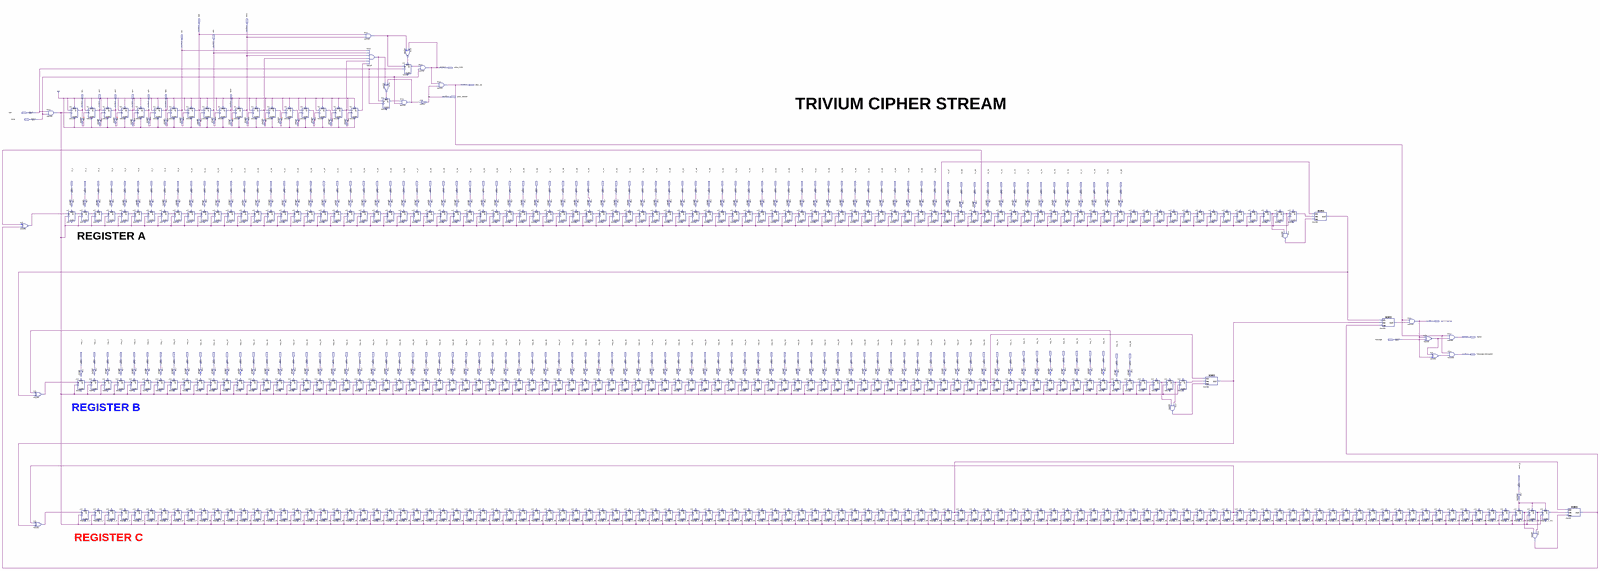
[diagram p0: schematic sheet, whole]
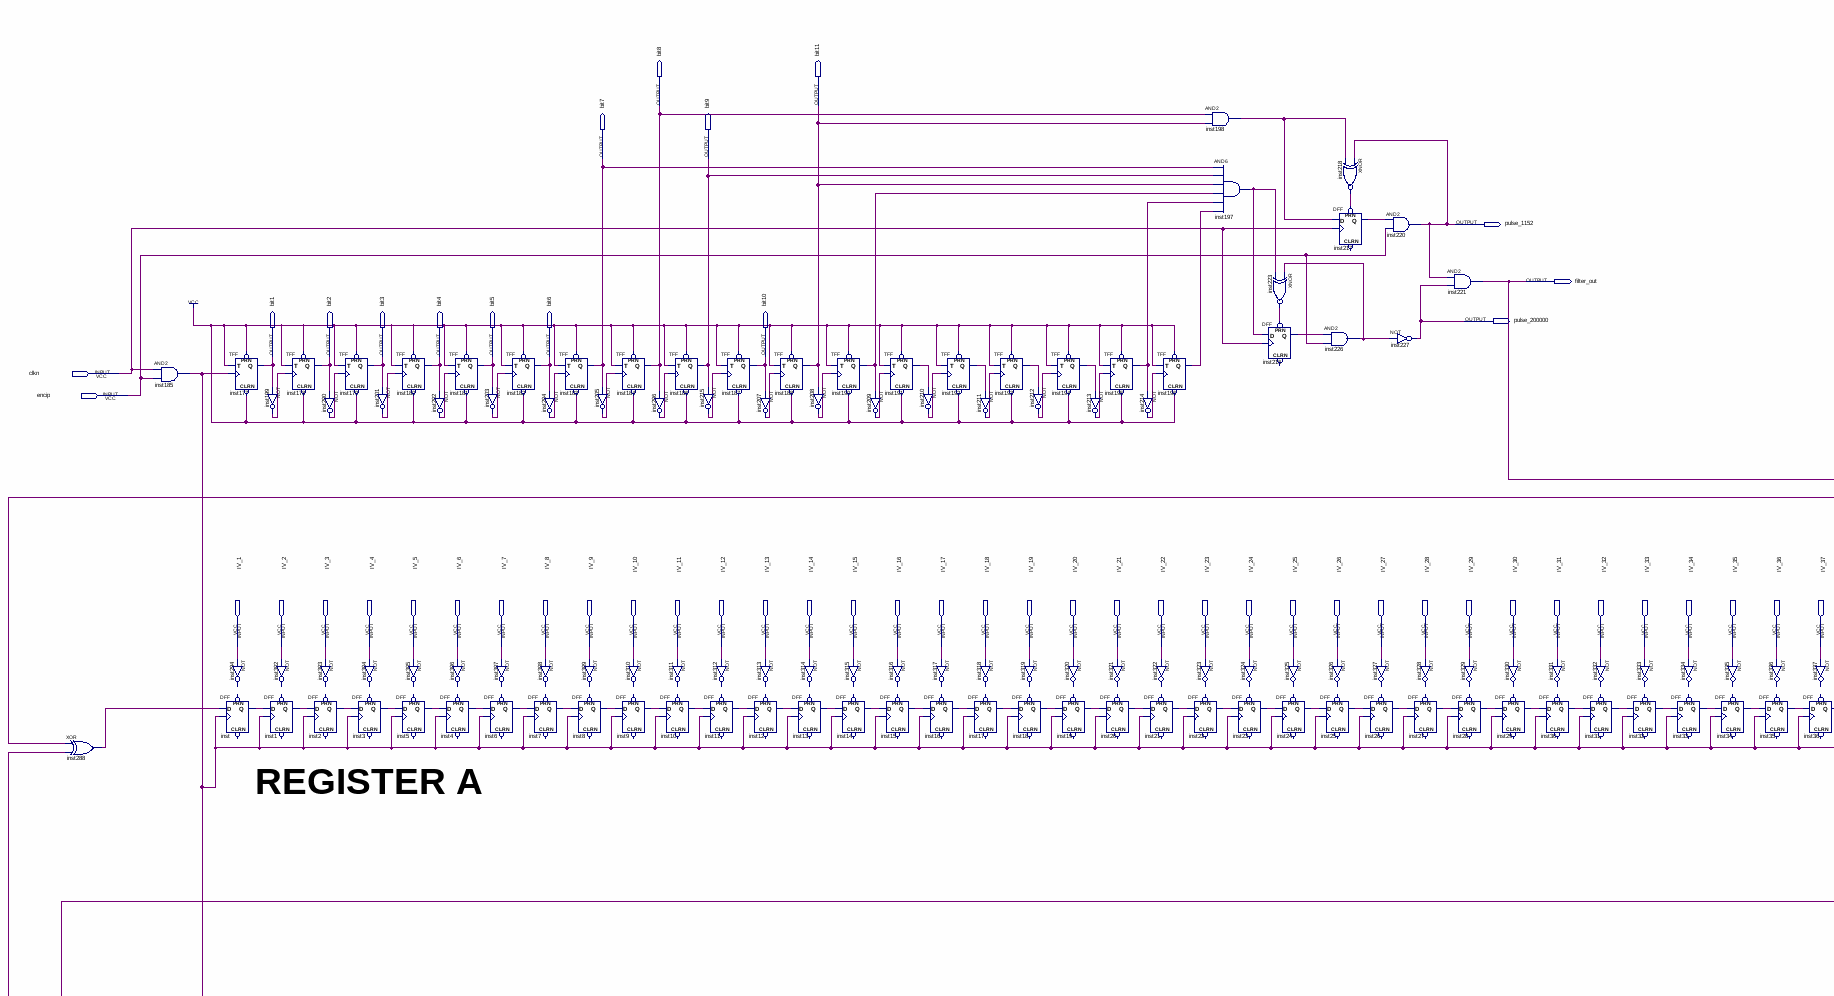
[diagram p1: schematic sheet, upper left part]
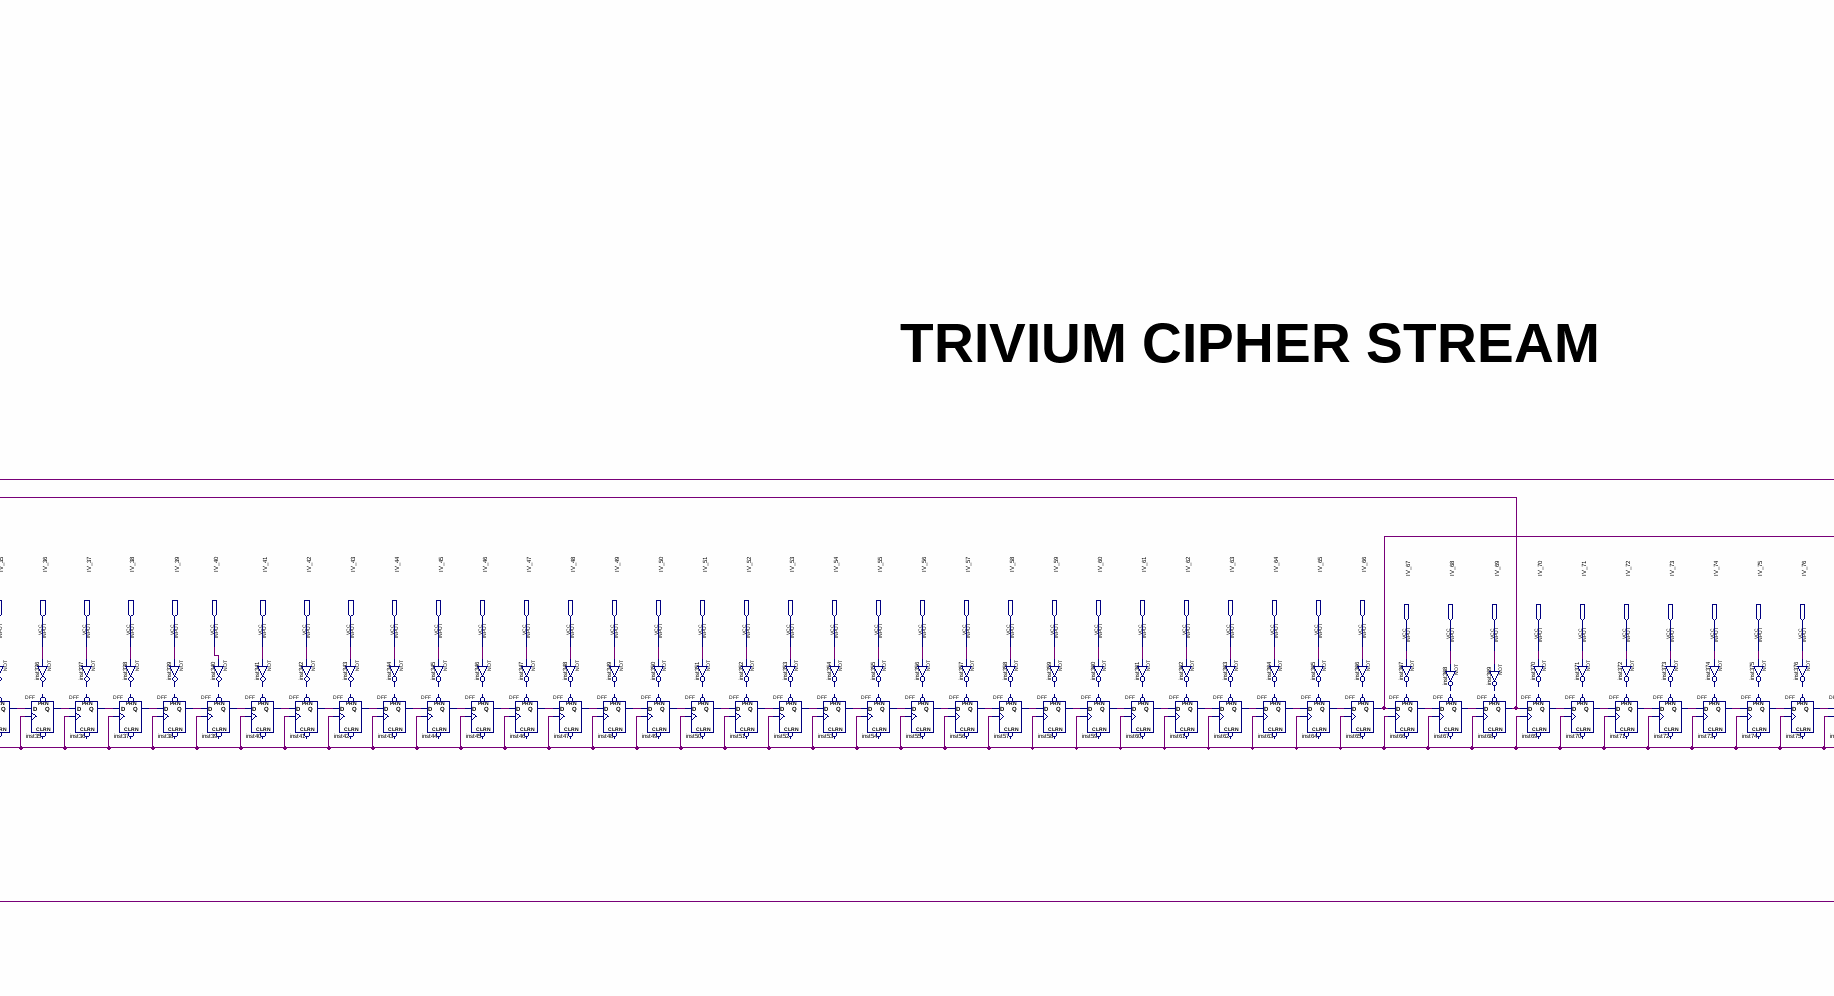
[diagram p2: schematic sheet, upper centre part]
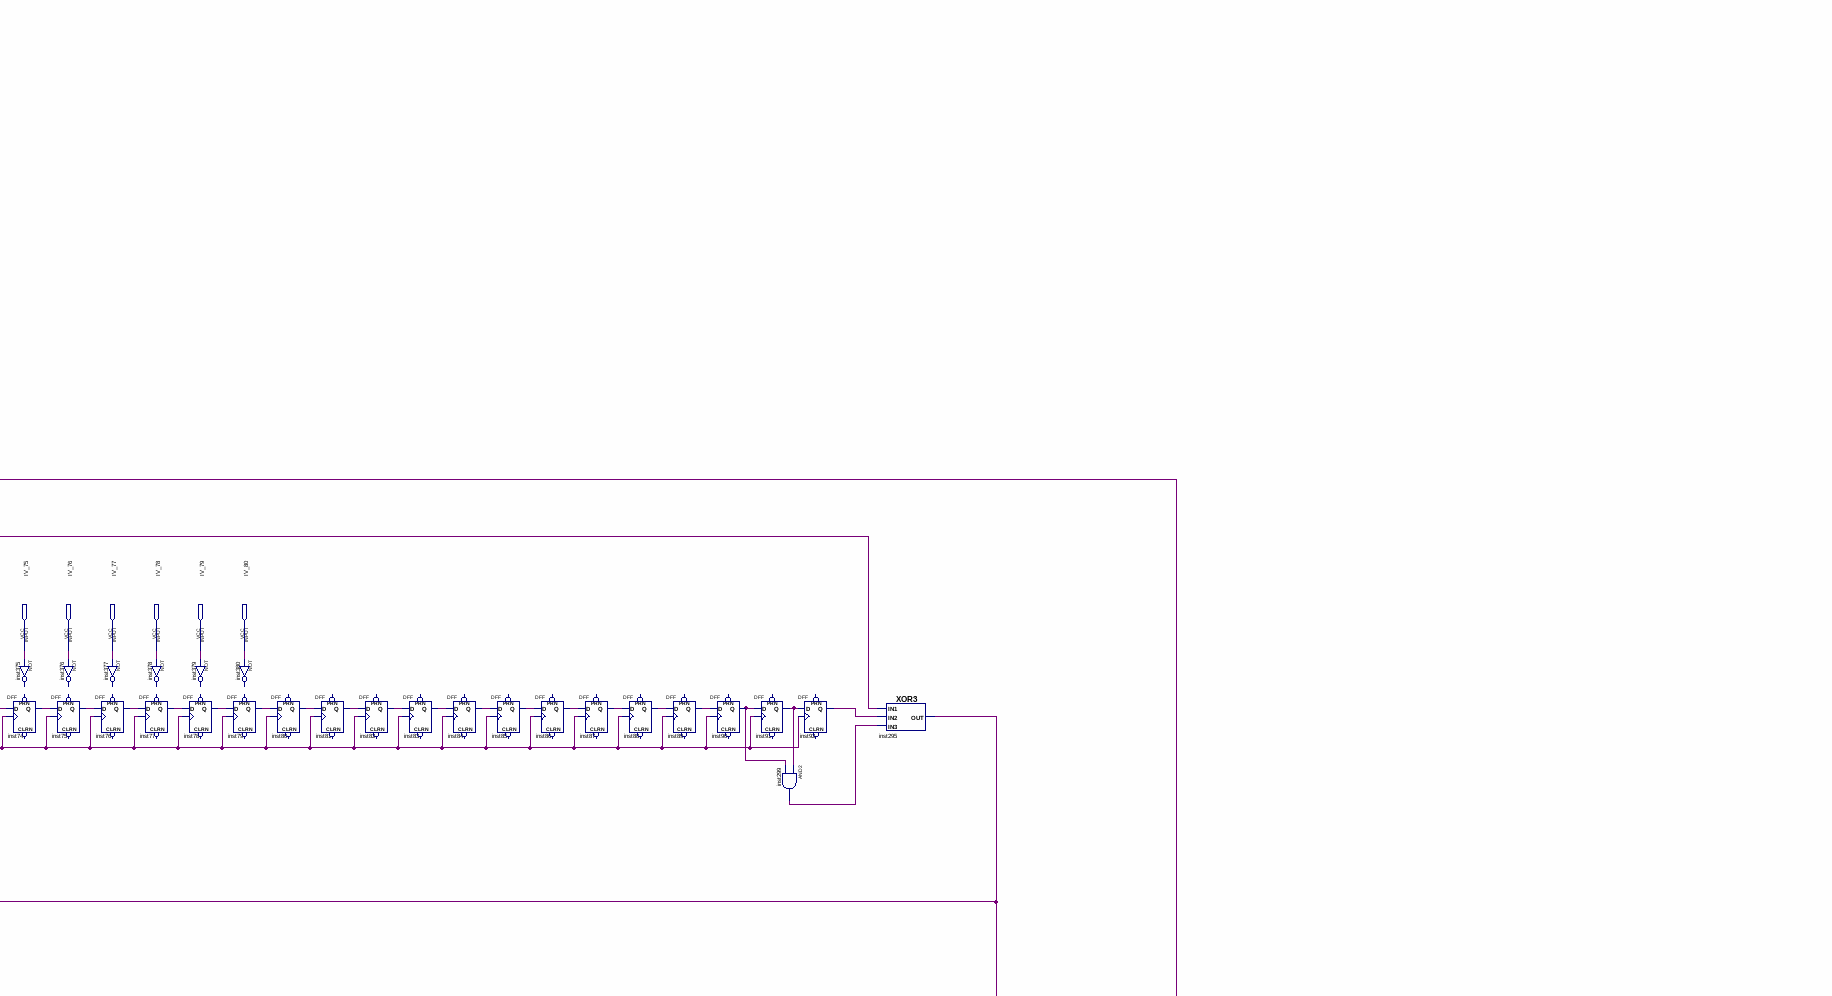
[diagram p3: schematic sheet, upper right part]
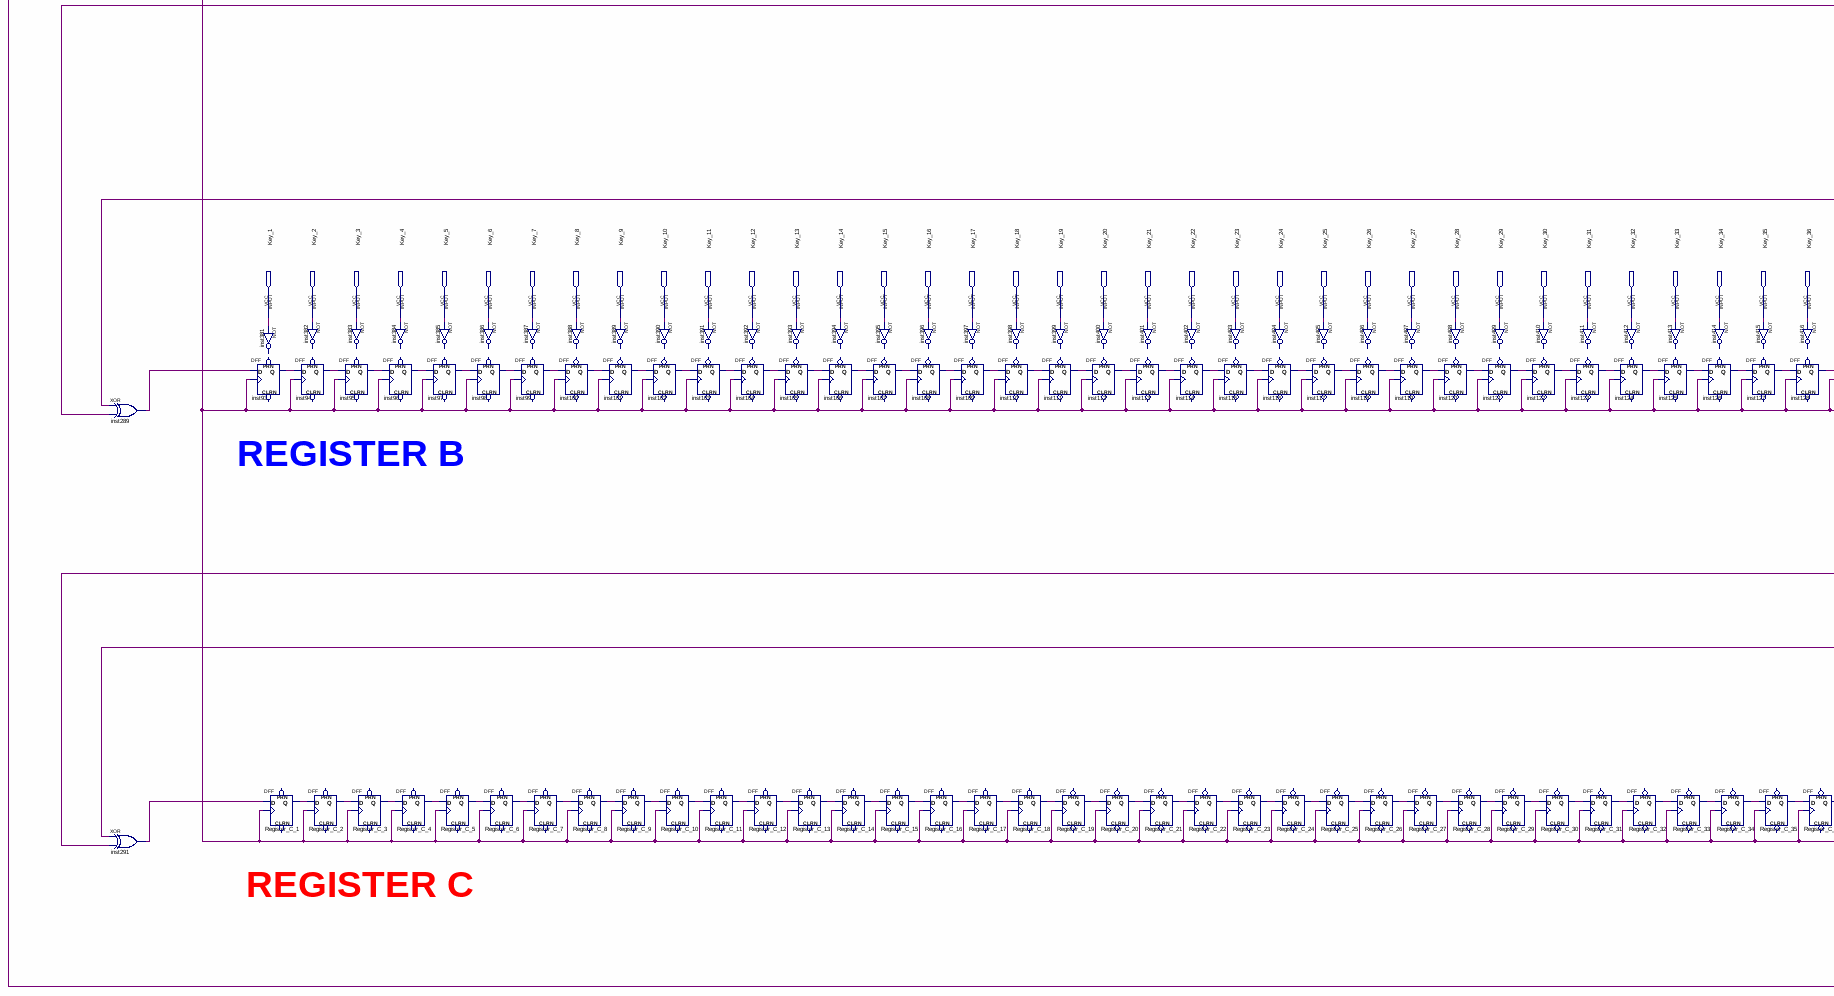
[diagram p4: schematic sheet, lower left part]
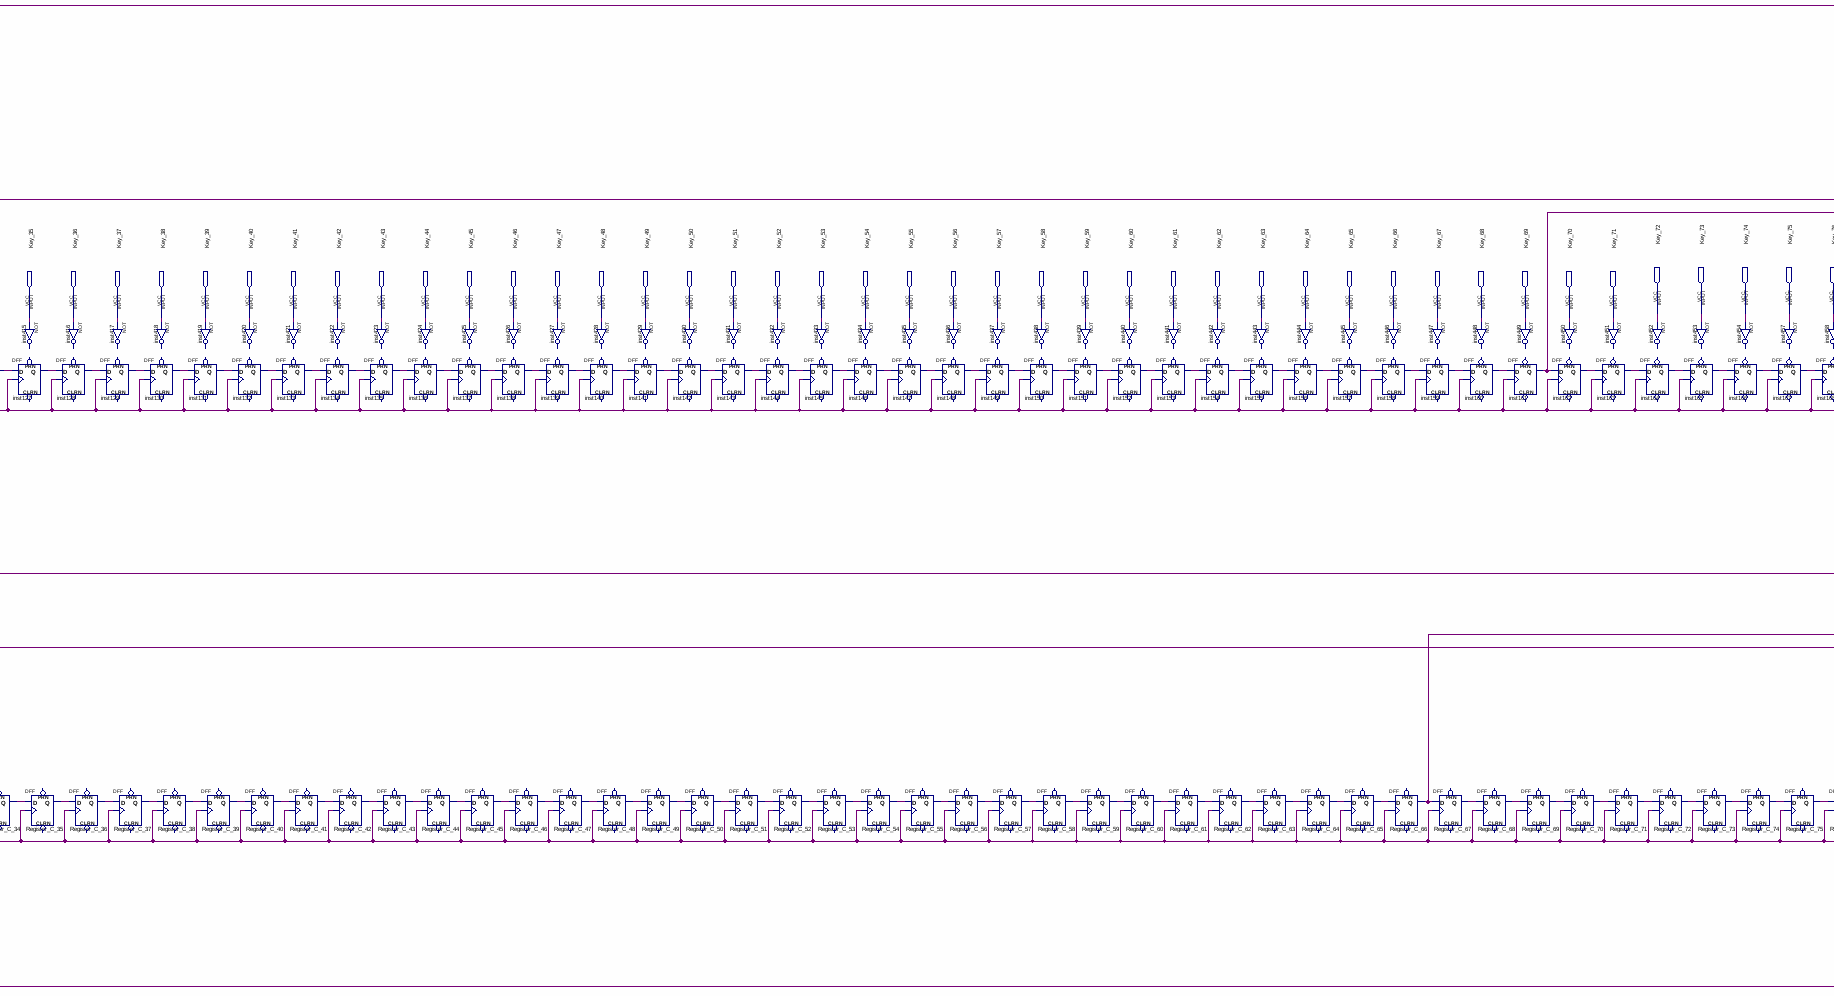
[diagram p5: schematic sheet, lower centre part]
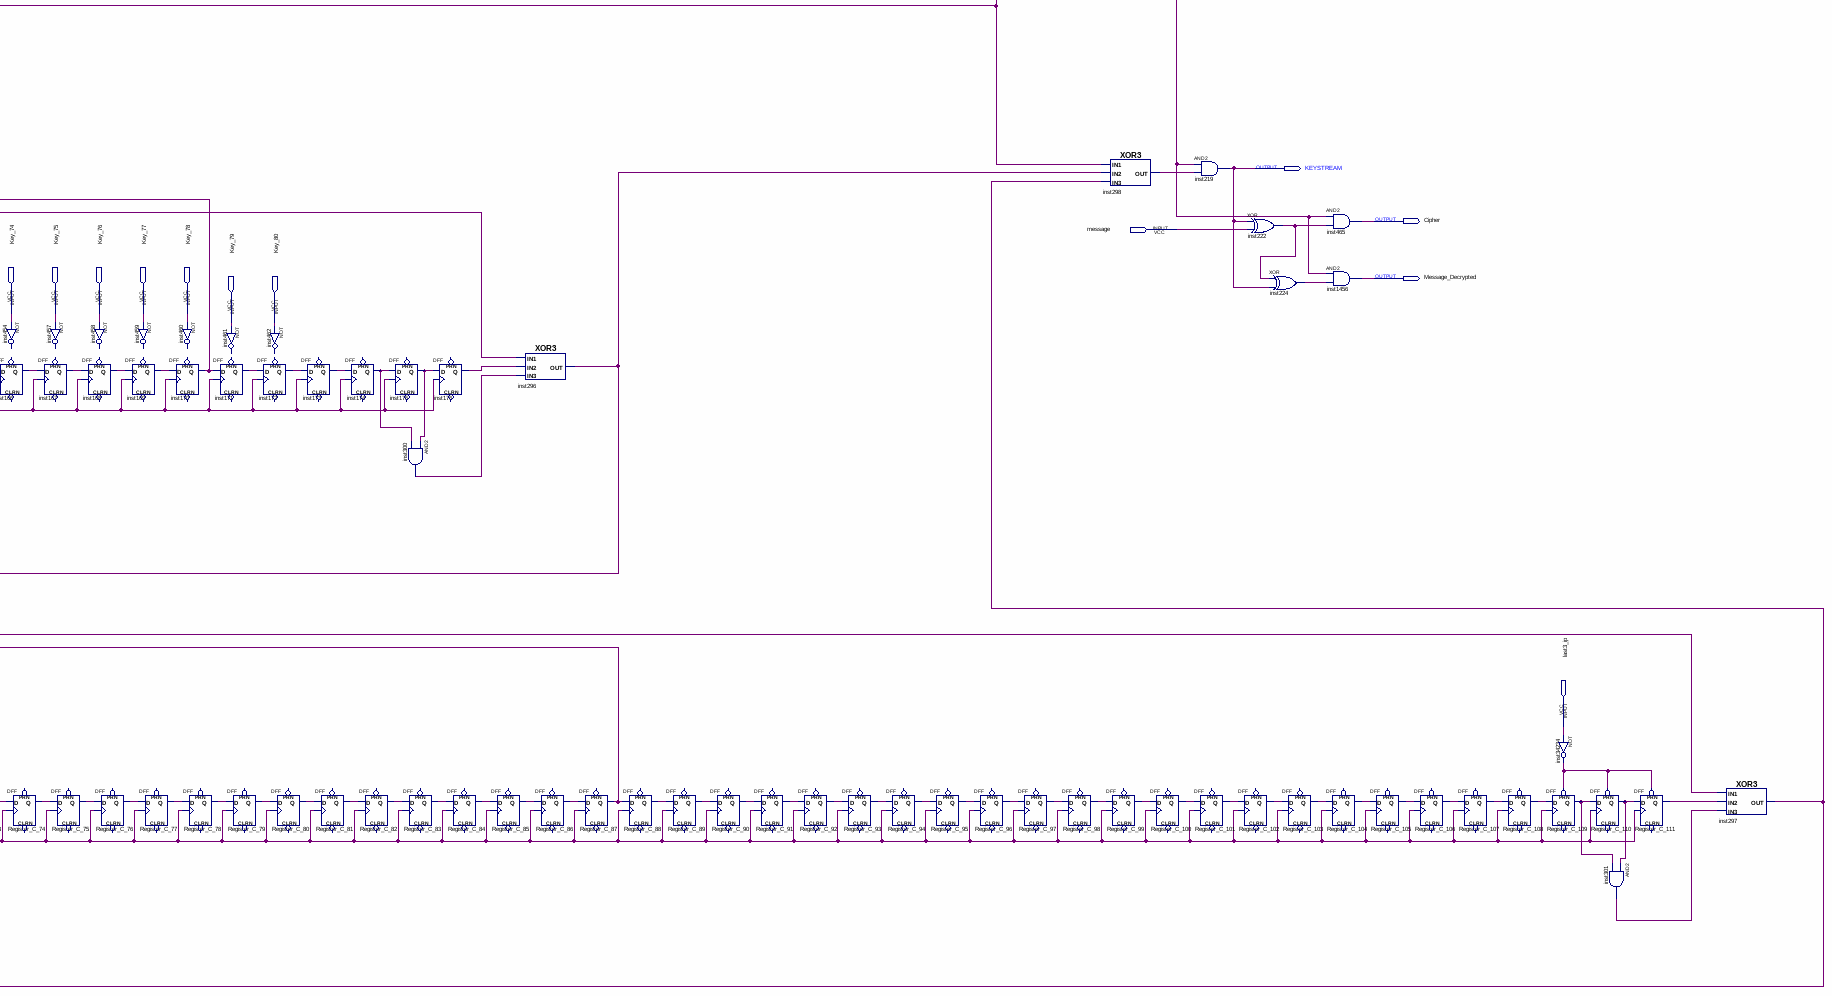
[diagram p6: schematic sheet, lower right part]
// Quartus schematic trivium1.bdf as structural Verilog: 510 symbols, 181 pins
module trivium1 (
  input  clkn,
  input  encip,
  input  IV_1,
  input  IV_2,
  input  IV_3,
  input  IV_4,
  input  IV_5,
  input  IV_6,
  input  IV_7,
  input  IV_8,
  input  IV_9,
  input  IV_10,
  input  IV_11,
  input  IV_12,
  input  IV_13,
  input  IV_14,
  input  IV_15,
  input  IV_16,
  input  IV_17,
  input  IV_18,
  input  IV_19,
  input  IV_20,
  input  IV_21,
  input  IV_22,
  input  IV_23,
  input  IV_24,
  input  IV_25,
  input  IV_26,
  input  IV_27,
  input  IV_28,
  input  IV_29,
  input  IV_30,
  input  IV_31,
  input  IV_32,
  input  IV_33,
  input  IV_34,
  input  IV_35,
  input  IV_36,
  input  IV_37,
  input  IV_38,
  input  IV_39,
  input  IV_40,
  input  IV_41,
  input  IV_42,
  input  IV_43,
  input  IV_44,
  input  IV_45,
  input  IV_46,
  input  IV_47,
  input  IV_48,
  input  IV_49,
  input  IV_50,
  input  IV_51,
  input  IV_52,
  input  IV_53,
  input  IV_54,
  input  IV_55,
  input  IV_56,
  input  IV_57,
  input  IV_58,
  input  IV_59,
  input  IV_60,
  input  IV_61,
  input  IV_62,
  input  IV_63,
  input  IV_64,
  input  IV_65,
  input  IV_66,
  input  IV_67,
  input  IV_68,
  input  IV_69,
  input  IV_70,
  input  IV_71,
  input  IV_72,
  input  IV_73,
  input  IV_74,
  input  IV_75,
  input  IV_76,
  input  IV_77,
  input  IV_78,
  input  IV_79,
  input  IV_80,
  input  message,
  input  Key_72,
  input  Key_73,
  input  Key_74,
  input  Key_75,
  input  Key_76,
  input  Key_77,
  input  Key_78,
  input  Key_1,
  input  Key_2,
  input  Key_3,
  input  Key_4,
  input  Key_5,
  input  Key_6,
  input  Key_7,
  input  Key_8,
  input  Key_9,
  input  Key_10,
  input  Key_11,
  input  Key_12,
  input  Key_13,
  input  Key_14,
  input  Key_15,
  input  Key_16,
  input  Key_17,
  input  Key_18,
  input  Key_19,
  input  Key_20,
  input  Key_21,
  input  Key_22,
  input  Key_23,
  input  Key_24,
  input  Key_25,
  input  Key_26,
  input  Key_27,
  input  Key_28,
  input  Key_29,
  input  Key_30,
  input  Key_31,
  input  Key_32,
  input  Key_33,
  input  Key_34,
  input  Key_35,
  input  Key_36,
  input  Key_37,
  input  Key_38,
  input  Key_39,
  input  Key_40,
  input  Key_41,
  input  Key_42,
  input  Key_43,
  input  Key_44,
  input  Key_45,
  input  Key_46,
  input  Key_47,
  input  Key_48,
  input  Key_49,
  input  Key_50,
  input  Key_51,
  input  Key_52,
  input  Key_53,
  input  Key_54,
  input  Key_55,
  input  Key_56,
  input  Key_57,
  input  Key_58,
  input  Key_59,
  input  Key_60,
  input  Key_61,
  input  Key_62,
  input  Key_63,
  input  Key_64,
  input  Key_65,
  input  Key_66,
  input  Key_67,
  input  Key_68,
  input  Key_69,
  input  Key_70,
  input  Key_71,
  input  Key_79,
  input  Key_80,
  input  last3_ip,
  output bit8,
  output bit11,
  output bit7,
  output bit9,
  output pulse_1152,
  output filter_out,
  output pulse_200000,
  output bit1,
  output bit2,
  output bit3,
  output bit4,
  output bit5,
  output bit6,
  output bit10,
  output KEYSTREAM,
  output Cipher,
  output Message_Decrypted
);

  wire inst1_q, inst2_q, inst3_q, inst4_q, inst5_q, inst6_q, inst7_q, inst8_q, inst9_q, inst10_q, inst11_q,
       inst12_q, inst13_q, inst14_q, inst15_q, inst16_q, inst17_q, inst18_q, inst19_q, inst20_q, inst21_q,
       inst22_q, inst23_q, inst24_q, inst25_q, inst26_q, inst27_q, inst28_q, inst29_q, inst30_q, inst31_q,
       inst32_q, inst33_q, inst34_q, inst35_q, inst36_q, inst37_q, inst38_q, inst39_q, inst40_q, inst41_q,
       inst42_q, inst43_q, inst44_q, inst45_q, inst46_q, inst47_q, inst48_q, inst49_q, inst50_q, inst51_q,
       inst52_q, inst53_q, inst54_q, inst55_q, inst56_q, inst57_q, inst58_q, inst59_q, inst60_q, inst61_q,
       inst62_q, inst63_q, inst64_q, inst65_q, inst66_q, inst67_q, inst68_q, inst69_q, inst70_q, inst71_q,
       inst72_q, inst73_q, inst74_q, inst75_q, inst76_q, inst77_q, inst78_q, inst79_q, inst80_q, inst81_q,
       inst82_q, inst83_q, inst84_q, inst85_q, inst86_q, inst87_q, inst88_q, inst89_q, inst90_q, inst91_q,
       inst92_q, inst93_q, inst94_q, inst95_q, inst96_q, inst97_q, inst98_q, inst99_q, inst100_q, inst101_q,
       inst102_q, inst103_q, inst104_q, inst105_q, inst106_q, inst107_q, inst108_q, inst109_q, inst110_q,
       inst111_q, inst112_q, inst113_q, inst114_q, inst115_q, inst116_q, inst117_q, inst118_q, inst119_q,
       inst120_q, inst121_q, inst122_q, inst123_q, inst124_q, inst125_q, inst126_q, inst127_q, inst128_q,
       inst129_q, inst130_q, inst131_q, inst132_q, inst133_q, inst134_q, inst135_q, inst136_q, inst137_q,
       inst138_q, inst139_q, inst140_q, inst141_q, inst142_q, inst143_q, inst144_q, inst145_q, inst146_q,
       inst147_q, inst148_q, inst149_q, inst150_q, inst151_q, inst152_q, inst153_q, inst154_q, inst155_q,
       inst156_q, inst157_q, inst158_q, inst159_q, inst160_q, inst161_q, inst162_q, inst163_q, inst164_q,
       inst165_q, inst166_q, inst167_q, inst168_q, inst169_q, inst170_q, inst171_q, inst172_q, inst173_q,
       inst174_q, inst175_q, inst176_q, inst185_out, inst190_q, inst191_q, inst192_q, inst193_q, inst194_q,
       inst195_q, inst196_q, inst197_out, inst198_out, inst199_out, inst200_out, inst201_out, inst202_out,
       inst203_out, inst204_out, inst205_out, inst206_out, inst207_out, inst208_out, inst209_out,
       inst210_out, inst211_out, inst212_out, inst213_out, inst214_out, inst215_out, inst216_q, inst217_q,
       inst218_out, inst222_out, inst223_out, inst224_out, inst226_out, inst288_out, inst289_out,
       inst291_out, inst295_out, inst296_out, inst297_out, inst298_out, inst299_out, inst300_out,
       inst301_out, inst34234_out, inst_q, Register_C_1_q, Register_C_2_q, Register_C_3_q, Register_C_4_q,
       Register_C_5_q, Register_C_6_q, Register_C_7_q, Register_C_8_q, Register_C_9_q, Register_C_10_q,
       Register_C_11_q, Register_C_12_q, Register_C_13_q, Register_C_14_q, Register_C_15_q, Register_C_16_q,
       Register_C_17_q, Register_C_18_q, Register_C_19_q, Register_C_20_q, Register_C_21_q, Register_C_22_q,
       Register_C_23_q, Register_C_24_q, Register_C_25_q, Register_C_26_q, Register_C_27_q, Register_C_28_q,
       Register_C_29_q, Register_C_30_q, Register_C_31_q, Register_C_32_q, Register_C_33_q, Register_C_34_q,
       Register_C_35_q, Register_C_36_q, Register_C_37_q, Register_C_38_q, Register_C_39_q, Register_C_40_q,
       Register_C_41_q, Register_C_42_q, Register_C_43_q, Register_C_44_q, Register_C_45_q, Register_C_46_q,
       Register_C_47_q, Register_C_48_q, Register_C_49_q, Register_C_50_q, Register_C_51_q, Register_C_52_q,
       Register_C_53_q, Register_C_54_q, Register_C_55_q, Register_C_56_q, Register_C_57_q, Register_C_58_q,
       Register_C_59_q, Register_C_60_q, Register_C_61_q, Register_C_62_q, Register_C_63_q, Register_C_64_q,
       Register_C_65_q, Register_C_66_q, Register_C_67_q, Register_C_68_q, Register_C_69_q, Register_C_70_q,
       Register_C_71_q, Register_C_72_q, Register_C_73_q, Register_C_74_q, Register_C_75_q, Register_C_76_q,
       Register_C_77_q, Register_C_78_q, Register_C_79_q, Register_C_80_q, Register_C_81_q, Register_C_82_q,
       Register_C_83_q, Register_C_84_q, Register_C_85_q, Register_C_86_q, Register_C_87_q, Register_C_88_q,
       Register_C_89_q, Register_C_90_q, Register_C_91_q, Register_C_92_q, Register_C_93_q, Register_C_94_q,
       Register_C_95_q, Register_C_96_q, Register_C_97_q, Register_C_98_q, Register_C_99_q, Register_C_100_q,
       Register_C_101_q, Register_C_102_q, Register_C_103_q, Register_C_104_q, Register_C_105_q,
       Register_C_106_q, Register_C_107_q, Register_C_108_q, Register_C_109_q, Register_C_110_q,
       Register_C_111_q;

  xor inst288 (inst288_out, inst68_q, inst297_out);
  xor inst289 (inst289_out, inst170_q, inst295_out);
  xor inst291 (inst291_out, Register_C_87_q, inst296_out);
  and inst185 (inst185_out, clkn, encip);
  TFF inst177 (.PRN(1'b1), .CLRN(1'b1), .T(1'b1), .CLK(inst185_out), .Q(bit1));
  // NOT inst294 has open pins: IN=IV_1, OUT=open
  DFF inst (.CLK(inst185_out), .D(inst288_out), .Q(inst_q));  // open: CLRN, PRN
  not inst199 (inst199_out, bit1);
  // NOT inst302 has open pins: IN=IV_2, OUT=open
  DFF inst1 (.CLK(inst185_out), .D(inst_q), .Q(inst1_q));  // open: CLRN, PRN
  // NOT inst381 has open pins: IN=Key_1, OUT=open
  DFF inst93 (.CLK(inst185_out), .D(inst289_out), .Q(inst93_q));  // open: CLRN, PRN
  DFF Register_C_1 (.CLK(inst185_out), .D(inst291_out), .Q(Register_C_1_q));  // open: CLRN, PRN
  TFF inst178 (.PRN(1'b1), .CLRN(1'b1), .T(1'b1), .CLK(inst199_out), .Q(bit2));
  // NOT inst303 has open pins: IN=IV_3, OUT=open
  DFF inst2 (.CLK(inst185_out), .D(inst1_q), .Q(inst2_q));  // open: CLRN, PRN
  // NOT inst382 has open pins: IN=Key_2, OUT=open
  DFF inst94 (.CLK(inst185_out), .D(inst93_q), .Q(inst94_q));  // open: CLRN, PRN
  DFF Register_C_2 (.CLK(inst185_out), .D(Register_C_1_q), .Q(Register_C_2_q));  // open: CLRN, PRN
  TFF inst179 (.PRN(1'b1), .CLRN(1'b1), .T(1'b1), .CLK(inst200_out), .Q(bit3));
  not inst200 (inst200_out, bit2);
  DFF inst3 (.CLK(inst185_out), .D(inst2_q), .Q(inst3_q));  // open: CLRN, PRN
  // NOT inst383 has open pins: IN=Key_3, OUT=open
  DFF inst95 (.CLK(inst185_out), .D(inst94_q), .Q(inst95_q));  // open: CLRN, PRN
  DFF Register_C_3 (.CLK(inst185_out), .D(Register_C_2_q), .Q(Register_C_3_q));  // open: CLRN, PRN
  not inst201 (inst201_out, bit3);
  // NOT inst304 has open pins: IN=IV_4, OUT=open
  DFF inst96 (.CLK(inst185_out), .D(inst95_q), .Q(inst96_q));  // open: CLRN, PRN
  TFF inst180 (.PRN(1'b1), .CLRN(1'b1), .T(1'b1), .CLK(inst201_out), .Q(bit4));
  // NOT inst305 has open pins: IN=IV_5, OUT=open
  DFF inst5 (.CLK(inst185_out), .D(inst3_q), .Q(inst5_q));  // open: CLRN, PRN
  // NOT inst384 has open pins: IN=Key_4, OUT=open
  DFF Register_C_4 (.CLK(inst185_out), .D(Register_C_3_q), .Q(Register_C_4_q));  // open: CLRN, PRN
  TFF inst181 (.PRN(1'b1), .CLRN(1'b1), .T(1'b1), .CLK(inst202_out), .Q(bit5));
  not inst202 (inst202_out, bit4);
  // NOT inst306 has open pins: IN=IV_6, OUT=open
  DFF inst4 (.CLK(inst185_out), .D(inst5_q), .Q(inst4_q));  // open: CLRN, PRN
  // NOT inst385 has open pins: IN=Key_5, OUT=open
  DFF inst97 (.CLK(inst185_out), .D(inst96_q), .Q(inst97_q));  // open: CLRN, PRN
  DFF Register_C_5 (.CLK(inst185_out), .D(Register_C_4_q), .Q(Register_C_5_q));  // open: CLRN, PRN
  not inst203 (inst203_out, bit5);
  // NOT inst307 has open pins: IN=IV_7, OUT=open
  DFF inst6 (.CLK(inst185_out), .D(inst4_q), .Q(inst6_q));  // open: CLRN, PRN
  // NOT inst386 has open pins: IN=Key_6, OUT=open
  DFF inst98 (.CLK(inst185_out), .D(inst97_q), .Q(inst98_q));  // open: CLRN, PRN
  DFF Register_C_6 (.CLK(inst185_out), .D(Register_C_5_q), .Q(Register_C_6_q));  // open: CLRN, PRN
  TFF inst182 (.PRN(1'b1), .CLRN(1'b1), .T(1'b1), .CLK(inst203_out), .Q(bit6));
  DFF inst7 (.CLK(inst185_out), .D(inst6_q), .Q(inst7_q));  // open: CLRN, PRN
  // NOT inst387 has open pins: IN=Key_7, OUT=open
  DFF inst99 (.CLK(inst185_out), .D(inst98_q), .Q(inst99_q));  // open: CLRN, PRN
  DFF Register_C_7 (.CLK(inst185_out), .D(Register_C_6_q), .Q(Register_C_7_q));  // open: CLRN, PRN
  TFF inst183 (.PRN(1'b1), .CLRN(1'b1), .T(1'b1), .CLK(inst204_out), .Q(bit7));
  not inst204 (inst204_out, bit6);
  // NOT inst308 has open pins: IN=IV_8, OUT=open
  DFF inst100 (.CLK(inst185_out), .D(inst99_q), .Q(inst100_q));  // open: CLRN, PRN
  not inst205 (inst205_out, bit7);
  // NOT inst309 has open pins: IN=IV_9, OUT=open
  DFF inst8 (.CLK(inst185_out), .D(inst7_q), .Q(inst8_q));  // open: CLRN, PRN
  // NOT inst388 has open pins: IN=Key_8, OUT=open
  DFF Register_C_8 (.CLK(inst185_out), .D(Register_C_7_q), .Q(Register_C_8_q));  // open: CLRN, PRN
  TFF inst184 (.PRN(1'b1), .CLRN(1'b1), .T(1'b1), .CLK(inst205_out), .Q(bit8));
  // NOT inst310 has open pins: IN=IV_10, OUT=open
  DFF inst9 (.CLK(inst185_out), .D(inst8_q), .Q(inst9_q));  // open: CLRN, PRN
  // NOT inst389 has open pins: IN=Key_9, OUT=open
  DFF inst101 (.CLK(inst185_out), .D(inst100_q), .Q(inst101_q));  // open: CLRN, PRN
  DFF Register_C_9 (.CLK(inst185_out), .D(Register_C_8_q), .Q(Register_C_9_q));  // open: CLRN, PRN
  TFF inst186 (.PRN(1'b1), .CLRN(1'b1), .T(1'b1), .CLK(inst206_out), .Q(bit9));
  not inst206 (inst206_out, bit8);
  // NOT inst311 has open pins: IN=IV_11, OUT=open
  DFF inst10 (.CLK(inst185_out), .D(inst9_q), .Q(inst10_q));  // open: CLRN, PRN
  // NOT inst390 has open pins: IN=Key_10, OUT=open
  DFF inst102 (.CLK(inst185_out), .D(inst101_q), .Q(inst102_q));  // open: CLRN, PRN
  DFF Register_C_10 (.CLK(inst185_out), .D(Register_C_9_q), .Q(Register_C_10_q));  // open: CLRN, PRN
  not inst215 (inst215_out, bit9);
  DFF inst11 (.CLK(inst185_out), .D(inst10_q), .Q(inst11_q));  // open: CLRN, PRN
  // NOT inst391 has open pins: IN=Key_11, OUT=open
  DFF inst103 (.CLK(inst185_out), .D(inst102_q), .Q(inst103_q));  // open: CLRN, PRN
  DFF Register_C_11 (.CLK(inst185_out), .D(Register_C_10_q), .Q(Register_C_11_q));  // open: CLRN, PRN
  TFF inst187 (.PRN(1'b1), .CLRN(1'b1), .T(1'b1), .CLK(inst215_out), .Q(bit10));
  // NOT inst312 has open pins: IN=IV_12, OUT=open
  DFF inst104 (.CLK(inst185_out), .D(inst103_q), .Q(inst104_q));  // open: CLRN, PRN
  TFF inst188 (.PRN(1'b1), .CLRN(1'b1), .T(1'b1), .CLK(inst207_out), .Q(bit11));
  not inst207 (inst207_out, bit10);
  // NOT inst313 has open pins: IN=IV_13, OUT=open
  DFF inst12 (.CLK(inst185_out), .D(inst11_q), .Q(inst12_q));  // open: CLRN, PRN
  // NOT inst392 has open pins: IN=Key_12, OUT=open
  DFF Register_C_12 (.CLK(inst185_out), .D(Register_C_11_q), .Q(Register_C_12_q));  // open: CLRN, PRN
  not inst208 (inst208_out, bit11);
  // NOT inst314 has open pins: IN=IV_14, OUT=open
  DFF inst13 (.CLK(inst185_out), .D(inst12_q), .Q(inst13_q));  // open: CLRN, PRN
  // NOT inst393 has open pins: IN=Key_13, OUT=open
  DFF inst105 (.CLK(inst185_out), .D(inst104_q), .Q(inst105_q));  // open: CLRN, PRN
  DFF Register_C_13 (.CLK(inst185_out), .D(Register_C_12_q), .Q(Register_C_13_q));  // open: CLRN, PRN
  TFF inst190 (.PRN(1'b1), .CLRN(1'b1), .T(1'b1), .CLK(inst208_out), .Q(inst190_q));
  // NOT inst315 has open pins: IN=IV_15, OUT=open
  DFF inst14 (.CLK(inst185_out), .D(inst13_q), .Q(inst14_q));  // open: CLRN, PRN
  // NOT inst394 has open pins: IN=Key_14, OUT=open
  DFF inst106 (.CLK(inst185_out), .D(inst105_q), .Q(inst106_q));  // open: CLRN, PRN
  DFF Register_C_14 (.CLK(inst185_out), .D(Register_C_13_q), .Q(Register_C_14_q));  // open: CLRN, PRN
  not inst209 (inst209_out, inst190_q);
  DFF inst15 (.CLK(inst185_out), .D(inst14_q), .Q(inst15_q));  // open: CLRN, PRN
  // NOT inst395 has open pins: IN=Key_15, OUT=open
  DFF inst107 (.CLK(inst185_out), .D(inst106_q), .Q(inst107_q));  // open: CLRN, PRN
  DFF Register_C_15 (.CLK(inst185_out), .D(Register_C_14_q), .Q(Register_C_15_q));  // open: CLRN, PRN
  TFF inst191 (.PRN(1'b1), .CLRN(1'b1), .T(1'b1), .CLK(inst209_out), .Q(inst191_q));
  // NOT inst316 has open pins: IN=IV_16, OUT=open
  DFF inst108 (.CLK(inst185_out), .D(inst107_q), .Q(inst108_q));  // open: CLRN, PRN
  TFF inst192 (.PRN(1'b1), .CLRN(1'b1), .T(1'b1), .CLK(inst210_out), .Q(inst192_q));
  not inst210 (inst210_out, inst191_q);
  // NOT inst317 has open pins: IN=IV_17, OUT=open
  DFF inst16 (.CLK(inst185_out), .D(inst15_q), .Q(inst16_q));  // open: CLRN, PRN
  // NOT inst396 has open pins: IN=Key_16, OUT=open
  DFF Register_C_16 (.CLK(inst185_out), .D(Register_C_15_q), .Q(Register_C_16_q));  // open: CLRN, PRN
  not inst211 (inst211_out, inst192_q);
  // NOT inst318 has open pins: IN=IV_18, OUT=open
  DFF inst17 (.CLK(inst185_out), .D(inst16_q), .Q(inst17_q));  // open: CLRN, PRN
  // NOT inst397 has open pins: IN=Key_17, OUT=open
  DFF inst109 (.CLK(inst185_out), .D(inst108_q), .Q(inst109_q));  // open: CLRN, PRN
  DFF Register_C_17 (.CLK(inst185_out), .D(Register_C_16_q), .Q(Register_C_17_q));  // open: CLRN, PRN
  TFF inst193 (.PRN(1'b1), .CLRN(1'b1), .T(1'b1), .CLK(inst211_out), .Q(inst193_q));
  // NOT inst319 has open pins: IN=IV_19, OUT=open
  DFF inst18 (.CLK(inst185_out), .D(inst17_q), .Q(inst18_q));  // open: CLRN, PRN
  // NOT inst398 has open pins: IN=Key_18, OUT=open
  DFF inst110 (.CLK(inst185_out), .D(inst109_q), .Q(inst110_q));  // open: CLRN, PRN
  DFF Register_C_18 (.CLK(inst185_out), .D(Register_C_17_q), .Q(Register_C_18_q));  // open: CLRN, PRN
  TFF inst194 (.PRN(1'b1), .CLRN(1'b1), .T(1'b1), .CLK(inst212_out), .Q(inst194_q));
  not inst212 (inst212_out, inst193_q);
  DFF inst19 (.CLK(inst185_out), .D(inst18_q), .Q(inst19_q));  // open: CLRN, PRN
  // NOT inst399 has open pins: IN=Key_19, OUT=open
  DFF inst111 (.CLK(inst185_out), .D(inst110_q), .Q(inst111_q));  // open: CLRN, PRN
  DFF Register_C_19 (.CLK(inst185_out), .D(Register_C_18_q), .Q(Register_C_19_q));  // open: CLRN, PRN
  not inst213 (inst213_out, inst194_q);
  // NOT inst320 has open pins: IN=IV_20, OUT=open
  DFF inst112 (.CLK(inst185_out), .D(inst111_q), .Q(inst112_q));  // open: CLRN, PRN
  TFF inst195 (.PRN(1'b1), .CLRN(1'b1), .T(1'b1), .CLK(inst213_out), .Q(inst195_q));
  // NOT inst321 has open pins: IN=IV_21, OUT=open
  DFF inst20 (.CLK(inst185_out), .D(inst19_q), .Q(inst20_q));  // open: CLRN, PRN
  // NOT inst400 has open pins: IN=Key_20, OUT=open
  DFF Register_C_20 (.CLK(inst185_out), .D(Register_C_19_q), .Q(Register_C_20_q));  // open: CLRN, PRN
  TFF inst196 (.PRN(1'b1), .CLRN(1'b1), .T(1'b1), .CLK(inst214_out), .Q(inst196_q));
  not inst214 (inst214_out, inst195_q);
  // NOT inst322 has open pins: IN=IV_22, OUT=open
  DFF inst21 (.CLK(inst185_out), .D(inst20_q), .Q(inst21_q));  // open: CLRN, PRN
  // NOT inst401 has open pins: IN=Key_21, OUT=open
  DFF inst113 (.CLK(inst185_out), .D(inst112_q), .Q(inst113_q));  // open: CLRN, PRN
  DFF Register_C_21 (.CLK(inst185_out), .D(Register_C_20_q), .Q(Register_C_21_q));  // open: CLRN, PRN
  // NOT inst323 has open pins: IN=IV_23, OUT=open
  DFF inst22 (.CLK(inst185_out), .D(inst21_q), .Q(inst22_q));  // open: CLRN, PRN
  // NOT inst402 has open pins: IN=Key_22, OUT=open
  DFF inst114 (.CLK(inst185_out), .D(inst113_q), .Q(inst114_q));  // open: CLRN, PRN
  DFF Register_C_22 (.CLK(inst185_out), .D(Register_C_21_q), .Q(Register_C_22_q));  // open: CLRN, PRN
  and inst198 (inst198_out, bit8, bit11);
  and inst197 (inst197_out, bit7, bit9, bit11, inst190_q, inst195_q, inst196_q);
  DFF inst23 (.CLK(inst185_out), .D(inst22_q), .Q(inst23_q));  // open: CLRN, PRN
  // NOT inst403 has open pins: IN=Key_23, OUT=open
  DFF inst115 (.CLK(inst185_out), .D(inst114_q), .Q(inst115_q));  // open: CLRN, PRN
  DFF Register_C_23 (.CLK(inst185_out), .D(Register_C_22_q), .Q(Register_C_23_q));  // open: CLRN, PRN
  xnor inst223 (inst223_out, inst226_out, inst197_out);
  DFF inst216 (.CLK(clkn), .D(inst197_out), .PRN(inst223_out), .Q(inst216_q));  // open: CLRN
  // NOT inst324 has open pins: IN=IV_24, OUT=open
  DFF inst116 (.CLK(inst185_out), .D(inst115_q), .Q(inst116_q));  // open: CLRN, PRN
  // NOT inst325 has open pins: IN=IV_25, OUT=open
  DFF inst24 (.CLK(inst185_out), .D(inst23_q), .Q(inst24_q));  // open: CLRN, PRN
  // NOT inst404 has open pins: IN=Key_24, OUT=open
  DFF Register_C_24 (.CLK(inst185_out), .D(Register_C_23_q), .Q(Register_C_24_q));  // open: CLRN, PRN
  xnor inst218 (inst218_out, pulse_1152, inst198_out);
  DFF inst217 (.CLK(clkn), .D(inst198_out), .PRN(inst218_out), .Q(inst217_q));  // open: CLRN
  and inst226 (inst226_out, inst216_q, encip);
  // NOT inst326 has open pins: IN=IV_26, OUT=open
  DFF inst25 (.CLK(inst185_out), .D(inst24_q), .Q(inst25_q));  // open: CLRN, PRN
  // NOT inst405 has open pins: IN=Key_25, OUT=open
  DFF inst117 (.CLK(inst185_out), .D(inst116_q), .Q(inst117_q));  // open: CLRN, PRN
  DFF Register_C_25 (.CLK(inst185_out), .D(Register_C_24_q), .Q(Register_C_25_q));  // open: CLRN, PRN
  // NOT inst327 has open pins: IN=IV_27, OUT=open
  DFF inst26 (.CLK(inst185_out), .D(inst25_q), .Q(inst26_q));  // open: CLRN, PRN
  // NOT inst406 has open pins: IN=Key_26, OUT=open
  DFF inst118 (.CLK(inst185_out), .D(inst117_q), .Q(inst118_q));  // open: CLRN, PRN
  DFF Register_C_26 (.CLK(inst185_out), .D(Register_C_25_q), .Q(Register_C_26_q));  // open: CLRN, PRN
  and inst220 (pulse_1152, inst217_q, encip);
  not inst227 (pulse_200000, inst226_out);
  DFF inst27 (.CLK(inst185_out), .D(inst26_q), .Q(inst27_q));  // open: CLRN, PRN
  // NOT inst407 has open pins: IN=Key_27, OUT=open
  DFF inst119 (.CLK(inst185_out), .D(inst118_q), .Q(inst119_q));  // open: CLRN, PRN
  DFF Register_C_27 (.CLK(inst185_out), .D(Register_C_26_q), .Q(Register_C_27_q));  // open: CLRN, PRN
  // NOT inst328 has open pins: IN=IV_28, OUT=open
  DFF inst120 (.CLK(inst185_out), .D(inst119_q), .Q(inst120_q));  // open: CLRN, PRN
  and inst221 (filter_out, pulse_1152, pulse_200000);
  // NOT inst329 has open pins: IN=IV_29, OUT=open
  DFF inst28 (.CLK(inst185_out), .D(inst27_q), .Q(inst28_q));  // open: CLRN, PRN
  // NOT inst408 has open pins: IN=Key_28, OUT=open
  DFF Register_C_28 (.CLK(inst185_out), .D(Register_C_27_q), .Q(Register_C_28_q));  // open: CLRN, PRN
  // NOT inst330 has open pins: IN=IV_30, OUT=open
  DFF inst29 (.CLK(inst185_out), .D(inst28_q), .Q(inst29_q));  // open: CLRN, PRN
  // NOT inst409 has open pins: IN=Key_29, OUT=open
  DFF inst121 (.CLK(inst185_out), .D(inst120_q), .Q(inst121_q));  // open: CLRN, PRN
  DFF Register_C_29 (.CLK(inst185_out), .D(Register_C_28_q), .Q(Register_C_29_q));  // open: CLRN, PRN
  // NOT inst331 has open pins: IN=IV_31, OUT=open
  DFF inst30 (.CLK(inst185_out), .D(inst29_q), .Q(inst30_q));  // open: CLRN, PRN
  // NOT inst410 has open pins: IN=Key_30, OUT=open
  DFF inst122 (.CLK(inst185_out), .D(inst121_q), .Q(inst122_q));  // open: CLRN, PRN
  DFF Register_C_30 (.CLK(inst185_out), .D(Register_C_29_q), .Q(Register_C_30_q));  // open: CLRN, PRN
  DFF inst31 (.CLK(inst185_out), .D(inst30_q), .Q(inst31_q));  // open: CLRN, PRN
  // NOT inst411 has open pins: IN=Key_31, OUT=open
  DFF inst123 (.CLK(inst185_out), .D(inst122_q), .Q(inst123_q));  // open: CLRN, PRN
  DFF Register_C_31 (.CLK(inst185_out), .D(Register_C_30_q), .Q(Register_C_31_q));  // open: CLRN, PRN
  // NOT inst332 has open pins: IN=IV_32, OUT=open
  DFF inst124 (.CLK(inst185_out), .D(inst123_q), .Q(inst124_q));  // open: CLRN, PRN
  // NOT inst333 has open pins: IN=IV_33, OUT=open
  DFF inst32 (.CLK(inst185_out), .D(inst31_q), .Q(inst32_q));  // open: CLRN, PRN
  // NOT inst412 has open pins: IN=Key_32, OUT=open
  DFF Register_C_32 (.CLK(inst185_out), .D(Register_C_31_q), .Q(Register_C_32_q));  // open: CLRN, PRN
  // NOT inst334 has open pins: IN=IV_34, OUT=open
  DFF inst33 (.CLK(inst185_out), .D(inst32_q), .Q(inst33_q));  // open: CLRN, PRN
  // NOT inst413 has open pins: IN=Key_33, OUT=open
  DFF inst125 (.CLK(inst185_out), .D(inst124_q), .Q(inst125_q));  // open: CLRN, PRN
  DFF Register_C_33 (.CLK(inst185_out), .D(Register_C_32_q), .Q(Register_C_33_q));  // open: CLRN, PRN
  // NOT inst335 has open pins: IN=IV_35, OUT=open
  DFF inst34 (.CLK(inst185_out), .D(inst33_q), .Q(inst34_q));  // open: CLRN, PRN
  // NOT inst414 has open pins: IN=Key_34, OUT=open
  DFF inst126 (.CLK(inst185_out), .D(inst125_q), .Q(inst126_q));  // open: CLRN, PRN
  DFF Register_C_34 (.CLK(inst185_out), .D(Register_C_33_q), .Q(Register_C_34_q));  // open: CLRN, PRN
  DFF inst35 (.CLK(inst185_out), .D(inst34_q), .Q(inst35_q));  // open: CLRN, PRN
  // NOT inst415 has open pins: IN=Key_35, OUT=open
  DFF inst127 (.CLK(inst185_out), .D(inst126_q), .Q(inst127_q));  // open: CLRN, PRN
  DFF Register_C_35 (.CLK(inst185_out), .D(Register_C_34_q), .Q(Register_C_35_q));  // open: CLRN, PRN
  // NOT inst336 has open pins: IN=IV_36, OUT=open
  DFF inst128 (.CLK(inst185_out), .D(inst127_q), .Q(inst128_q));  // open: CLRN, PRN
  // NOT inst337 has open pins: IN=IV_37, OUT=open
  DFF inst36 (.CLK(inst185_out), .D(inst35_q), .Q(inst36_q));  // open: CLRN, PRN
  // NOT inst416 has open pins: IN=Key_36, OUT=open
  DFF Register_C_36 (.CLK(inst185_out), .D(Register_C_35_q), .Q(Register_C_36_q));  // open: CLRN, PRN
  // NOT inst338 has open pins: IN=IV_38, OUT=open
  DFF inst37 (.CLK(inst185_out), .D(inst36_q), .Q(inst37_q));  // open: CLRN, PRN
  // NOT inst417 has open pins: IN=Key_37, OUT=open
  DFF inst129 (.CLK(inst185_out), .D(inst128_q), .Q(inst129_q));  // open: CLRN, PRN
  DFF Register_C_37 (.CLK(inst185_out), .D(Register_C_36_q), .Q(Register_C_37_q));  // open: CLRN, PRN
  // NOT inst339 has open pins: IN=IV_39, OUT=open
  DFF inst38 (.CLK(inst185_out), .D(inst37_q), .Q(inst38_q));  // open: CLRN, PRN
  // NOT inst418 has open pins: IN=Key_38, OUT=open
  DFF inst130 (.CLK(inst185_out), .D(inst129_q), .Q(inst130_q));  // open: CLRN, PRN
  DFF Register_C_38 (.CLK(inst185_out), .D(Register_C_37_q), .Q(Register_C_38_q));  // open: CLRN, PRN
  DFF inst39 (.CLK(inst185_out), .D(inst38_q), .Q(inst39_q));  // open: CLRN, PRN
  // NOT inst419 has open pins: IN=Key_39, OUT=open
  DFF inst131 (.CLK(inst185_out), .D(inst130_q), .Q(inst131_q));  // open: CLRN, PRN
  DFF Register_C_39 (.CLK(inst185_out), .D(Register_C_38_q), .Q(Register_C_39_q));  // open: CLRN, PRN
  // NOT inst340 has open pins: IN=IV_40, OUT=open
  DFF inst132 (.CLK(inst185_out), .D(inst131_q), .Q(inst132_q));  // open: CLRN, PRN
  // NOT inst341 has open pins: IN=IV_41, OUT=open
  DFF inst40 (.CLK(inst185_out), .D(inst39_q), .Q(inst40_q));  // open: CLRN, PRN
  // NOT inst420 has open pins: IN=Key_40, OUT=open
  DFF Register_C_40 (.CLK(inst185_out), .D(Register_C_39_q), .Q(Register_C_40_q));  // open: CLRN, PRN
  // NOT inst342 has open pins: IN=IV_42, OUT=open
  DFF inst41 (.CLK(inst185_out), .D(inst40_q), .Q(inst41_q));  // open: CLRN, PRN
  // NOT inst421 has open pins: IN=Key_41, OUT=open
  DFF inst133 (.CLK(inst185_out), .D(inst132_q), .Q(inst133_q));  // open: CLRN, PRN
  DFF Register_C_41 (.CLK(inst185_out), .D(Register_C_40_q), .Q(Register_C_41_q));  // open: CLRN, PRN
  // NOT inst343 has open pins: IN=IV_43, OUT=open
  DFF inst42 (.CLK(inst185_out), .D(inst41_q), .Q(inst42_q));  // open: CLRN, PRN
  // NOT inst422 has open pins: IN=Key_42, OUT=open
  DFF inst134 (.CLK(inst185_out), .D(inst133_q), .Q(inst134_q));  // open: CLRN, PRN
  DFF Register_C_42 (.CLK(inst185_out), .D(Register_C_41_q), .Q(Register_C_42_q));  // open: CLRN, PRN
  DFF inst43 (.CLK(inst185_out), .D(inst42_q), .Q(inst43_q));  // open: CLRN, PRN
  // NOT inst423 has open pins: IN=Key_43, OUT=open
  DFF inst135 (.CLK(inst185_out), .D(inst134_q), .Q(inst135_q));  // open: CLRN, PRN
  DFF Register_C_43 (.CLK(inst185_out), .D(Register_C_42_q), .Q(Register_C_43_q));  // open: CLRN, PRN
  // NOT inst344 has open pins: IN=IV_44, OUT=open
  DFF inst136 (.CLK(inst185_out), .D(inst135_q), .Q(inst136_q));  // open: CLRN, PRN
  // NOT inst345 has open pins: IN=IV_45, OUT=open
  DFF inst44 (.CLK(inst185_out), .D(inst43_q), .Q(inst44_q));  // open: CLRN, PRN
  // NOT inst424 has open pins: IN=Key_44, OUT=open
  DFF Register_C_44 (.CLK(inst185_out), .D(Register_C_43_q), .Q(Register_C_44_q));  // open: CLRN, PRN
  // NOT inst346 has open pins: IN=IV_46, OUT=open
  DFF inst45 (.CLK(inst185_out), .D(inst44_q), .Q(inst45_q));  // open: CLRN, PRN
  // NOT inst425 has open pins: IN=Key_45, OUT=open
  DFF inst137 (.CLK(inst185_out), .D(inst136_q), .Q(inst137_q));  // open: CLRN, PRN
  DFF Register_C_45 (.CLK(inst185_out), .D(Register_C_44_q), .Q(Register_C_45_q));  // open: CLRN, PRN
  // NOT inst347 has open pins: IN=IV_47, OUT=open
  DFF inst46 (.CLK(inst185_out), .D(inst45_q), .Q(inst46_q));  // open: CLRN, PRN
  // NOT inst426 has open pins: IN=Key_46, OUT=open
  DFF inst138 (.CLK(inst185_out), .D(inst137_q), .Q(inst138_q));  // open: CLRN, PRN
  DFF Register_C_46 (.CLK(inst185_out), .D(Register_C_45_q), .Q(Register_C_46_q));  // open: CLRN, PRN
  DFF inst47 (.CLK(inst185_out), .D(inst46_q), .Q(inst47_q));  // open: CLRN, PRN
  // NOT inst427 has open pins: IN=Key_47, OUT=open
  DFF inst139 (.CLK(inst185_out), .D(inst138_q), .Q(inst139_q));  // open: CLRN, PRN
  DFF Register_C_47 (.CLK(inst185_out), .D(Register_C_46_q), .Q(Register_C_47_q));  // open: CLRN, PRN
  // NOT inst348 has open pins: IN=IV_48, OUT=open
  DFF inst140 (.CLK(inst185_out), .D(inst139_q), .Q(inst140_q));  // open: CLRN, PRN
  // NOT inst349 has open pins: IN=IV_49, OUT=open
  DFF inst48 (.CLK(inst185_out), .D(inst47_q), .Q(inst48_q));  // open: CLRN, PRN
  // NOT inst428 has open pins: IN=Key_48, OUT=open
  DFF Register_C_48 (.CLK(inst185_out), .D(Register_C_47_q), .Q(Register_C_48_q));  // open: CLRN, PRN
  // NOT inst350 has open pins: IN=IV_50, OUT=open
  DFF inst49 (.CLK(inst185_out), .D(inst48_q), .Q(inst49_q));  // open: CLRN, PRN
  // NOT inst429 has open pins: IN=Key_49, OUT=open
  DFF inst141 (.CLK(inst185_out), .D(inst140_q), .Q(inst141_q));  // open: CLRN, PRN
  DFF Register_C_49 (.CLK(inst185_out), .D(Register_C_48_q), .Q(Register_C_49_q));  // open: CLRN, PRN
  // NOT inst351 has open pins: IN=IV_51, OUT=open
  DFF inst50 (.CLK(inst185_out), .D(inst49_q), .Q(inst50_q));  // open: CLRN, PRN
  // NOT inst430 has open pins: IN=Key_50, OUT=open
  DFF inst142 (.CLK(inst185_out), .D(inst141_q), .Q(inst142_q));  // open: CLRN, PRN
  DFF Register_C_50 (.CLK(inst185_out), .D(Register_C_49_q), .Q(Register_C_50_q));  // open: CLRN, PRN
  DFF inst51 (.CLK(inst185_out), .D(inst50_q), .Q(inst51_q));  // open: CLRN, PRN
  // NOT inst431 has open pins: IN=Key_51, OUT=open
  DFF inst143 (.CLK(inst185_out), .D(inst142_q), .Q(inst143_q));  // open: CLRN, PRN
  DFF Register_C_51 (.CLK(inst185_out), .D(Register_C_50_q), .Q(Register_C_51_q));  // open: CLRN, PRN
  // NOT inst352 has open pins: IN=IV_52, OUT=open
  DFF inst144 (.CLK(inst185_out), .D(inst143_q), .Q(inst144_q));  // open: CLRN, PRN
  // NOT inst353 has open pins: IN=IV_53, OUT=open
  DFF inst52 (.CLK(inst185_out), .D(inst51_q), .Q(inst52_q));  // open: CLRN, PRN
  // NOT inst432 has open pins: IN=Key_52, OUT=open
  DFF Register_C_52 (.CLK(inst185_out), .D(Register_C_51_q), .Q(Register_C_52_q));  // open: CLRN, PRN
  // NOT inst354 has open pins: IN=IV_54, OUT=open
  DFF inst53 (.CLK(inst185_out), .D(inst52_q), .Q(inst53_q));  // open: CLRN, PRN
  // NOT inst433 has open pins: IN=Key_53, OUT=open
  DFF inst145 (.CLK(inst185_out), .D(inst144_q), .Q(inst145_q));  // open: CLRN, PRN
  DFF Register_C_53 (.CLK(inst185_out), .D(Register_C_52_q), .Q(Register_C_53_q));  // open: CLRN, PRN
  // NOT inst355 has open pins: IN=IV_55, OUT=open
  DFF inst54 (.CLK(inst185_out), .D(inst53_q), .Q(inst54_q));  // open: CLRN, PRN
  // NOT inst434 has open pins: IN=Key_54, OUT=open
  DFF inst146 (.CLK(inst185_out), .D(inst145_q), .Q(inst146_q));  // open: CLRN, PRN
  DFF Register_C_54 (.CLK(inst185_out), .D(Register_C_53_q), .Q(Register_C_54_q));  // open: CLRN, PRN
  DFF inst55 (.CLK(inst185_out), .D(inst54_q), .Q(inst55_q));  // open: CLRN, PRN
  // NOT inst435 has open pins: IN=Key_55, OUT=open
  DFF inst147 (.CLK(inst185_out), .D(inst146_q), .Q(inst147_q));  // open: CLRN, PRN
  DFF Register_C_55 (.CLK(inst185_out), .D(Register_C_54_q), .Q(Register_C_55_q));  // open: CLRN, PRN
  // NOT inst356 has open pins: IN=IV_56, OUT=open
  DFF inst148 (.CLK(inst185_out), .D(inst147_q), .Q(inst148_q));  // open: CLRN, PRN
  // NOT inst357 has open pins: IN=IV_57, OUT=open
  DFF inst56 (.CLK(inst185_out), .D(inst55_q), .Q(inst56_q));  // open: CLRN, PRN
  // NOT inst436 has open pins: IN=Key_56, OUT=open
  DFF Register_C_56 (.CLK(inst185_out), .D(Register_C_55_q), .Q(Register_C_56_q));  // open: CLRN, PRN
  // NOT inst358 has open pins: IN=IV_58, OUT=open
  DFF inst57 (.CLK(inst185_out), .D(inst56_q), .Q(inst57_q));  // open: CLRN, PRN
  // NOT inst437 has open pins: IN=Key_57, OUT=open
  DFF inst149 (.CLK(inst185_out), .D(inst148_q), .Q(inst149_q));  // open: CLRN, PRN
  DFF Register_C_57 (.CLK(inst185_out), .D(Register_C_56_q), .Q(Register_C_57_q));  // open: CLRN, PRN
  // NOT inst359 has open pins: IN=IV_59, OUT=open
  DFF inst58 (.CLK(inst185_out), .D(inst57_q), .Q(inst58_q));  // open: CLRN, PRN
  // NOT inst438 has open pins: IN=Key_58, OUT=open
  DFF inst150 (.CLK(inst185_out), .D(inst149_q), .Q(inst150_q));  // open: CLRN, PRN
  DFF Register_C_58 (.CLK(inst185_out), .D(Register_C_57_q), .Q(Register_C_58_q));  // open: CLRN, PRN
  DFF inst59 (.CLK(inst185_out), .D(inst58_q), .Q(inst59_q));  // open: CLRN, PRN
  // NOT inst439 has open pins: IN=Key_59, OUT=open
  DFF inst151 (.CLK(inst185_out), .D(inst150_q), .Q(inst151_q));  // open: CLRN, PRN
  DFF Register_C_59 (.CLK(inst185_out), .D(Register_C_58_q), .Q(Register_C_59_q));  // open: CLRN, PRN
  // NOT inst360 has open pins: IN=IV_60, OUT=open
  DFF inst152 (.CLK(inst185_out), .D(inst151_q), .Q(inst152_q));  // open: CLRN, PRN
  // NOT inst361 has open pins: IN=IV_61, OUT=open
  DFF inst60 (.CLK(inst185_out), .D(inst59_q), .Q(inst60_q));  // open: CLRN, PRN
  // NOT inst440 has open pins: IN=Key_60, OUT=open
  DFF Register_C_60 (.CLK(inst185_out), .D(Register_C_59_q), .Q(Register_C_60_q));  // open: CLRN, PRN
  // NOT inst362 has open pins: IN=IV_62, OUT=open
  DFF inst61 (.CLK(inst185_out), .D(inst60_q), .Q(inst61_q));  // open: CLRN, PRN
  // NOT inst441 has open pins: IN=Key_61, OUT=open
  DFF inst153 (.CLK(inst185_out), .D(inst152_q), .Q(inst153_q));  // open: CLRN, PRN
  DFF Register_C_61 (.CLK(inst185_out), .D(Register_C_60_q), .Q(Register_C_61_q));  // open: CLRN, PRN
  // NOT inst363 has open pins: IN=IV_63, OUT=open
  DFF inst62 (.CLK(inst185_out), .D(inst61_q), .Q(inst62_q));  // open: CLRN, PRN
  // NOT inst442 has open pins: IN=Key_62, OUT=open
  DFF inst154 (.CLK(inst185_out), .D(inst153_q), .Q(inst154_q));  // open: CLRN, PRN
  DFF Register_C_62 (.CLK(inst185_out), .D(Register_C_61_q), .Q(Register_C_62_q));  // open: CLRN, PRN
  DFF inst63 (.CLK(inst185_out), .D(inst62_q), .Q(inst63_q));  // open: CLRN, PRN
  // NOT inst443 has open pins: IN=Key_63, OUT=open
  DFF inst155 (.CLK(inst185_out), .D(inst154_q), .Q(inst155_q));  // open: CLRN, PRN
  DFF Register_C_63 (.CLK(inst185_out), .D(Register_C_62_q), .Q(Register_C_63_q));  // open: CLRN, PRN
  // NOT inst364 has open pins: IN=IV_64, OUT=open
  DFF inst156 (.CLK(inst185_out), .D(inst155_q), .Q(inst156_q));  // open: CLRN, PRN
  // NOT inst365 has open pins: IN=IV_65, OUT=open
  DFF inst64 (.CLK(inst185_out), .D(inst63_q), .Q(inst64_q));  // open: CLRN, PRN
  // NOT inst444 has open pins: IN=Key_64, OUT=open
  DFF Register_C_64 (.CLK(inst185_out), .D(Register_C_63_q), .Q(Register_C_64_q));  // open: CLRN, PRN
  // NOT inst366 has open pins: IN=IV_66, OUT=open
  DFF inst65 (.CLK(inst185_out), .D(inst64_q), .Q(inst65_q));  // open: CLRN, PRN
  // NOT inst445 has open pins: IN=Key_65, OUT=open
  DFF inst157 (.CLK(inst185_out), .D(inst156_q), .Q(inst157_q));  // open: CLRN, PRN
  DFF Register_C_65 (.CLK(inst185_out), .D(Register_C_64_q), .Q(Register_C_65_q));  // open: CLRN, PRN
  // NOT inst367 has open pins: IN=IV_67, OUT=open
  DFF inst66 (.CLK(inst185_out), .D(inst65_q), .Q(inst66_q));  // open: CLRN, PRN
  // NOT inst446 has open pins: IN=Key_66, OUT=open
  DFF inst158 (.CLK(inst185_out), .D(inst157_q), .Q(inst158_q));  // open: CLRN, PRN
  DFF Register_C_66 (.CLK(inst185_out), .D(Register_C_65_q), .Q(Register_C_66_q));  // open: CLRN, PRN
  DFF inst67 (.CLK(inst185_out), .D(inst66_q), .Q(inst67_q));  // open: CLRN, PRN
  // NOT inst447 has open pins: IN=Key_67, OUT=open
  DFF inst159 (.CLK(inst185_out), .D(inst158_q), .Q(inst159_q));  // open: CLRN, PRN
  DFF Register_C_67 (.CLK(inst185_out), .D(Register_C_66_q), .Q(Register_C_67_q));  // open: CLRN, PRN
  // NOT inst368 has open pins: IN=IV_68, OUT=open
  DFF inst160 (.CLK(inst185_out), .D(inst159_q), .Q(inst160_q));  // open: CLRN, PRN
  // NOT inst369 has open pins: IN=IV_69, OUT=open
  DFF inst68 (.CLK(inst185_out), .D(inst67_q), .Q(inst68_q));  // open: CLRN, PRN
  // NOT inst448 has open pins: IN=Key_68, OUT=open
  DFF Register_C_68 (.CLK(inst185_out), .D(Register_C_67_q), .Q(Register_C_68_q));  // open: CLRN, PRN
  // NOT inst370 has open pins: IN=IV_70, OUT=open
  DFF inst69 (.CLK(inst185_out), .D(inst68_q), .Q(inst69_q));  // open: CLRN, PRN
  // NOT inst449 has open pins: IN=Key_69, OUT=open
  DFF inst161 (.CLK(inst185_out), .D(inst160_q), .Q(inst161_q));  // open: CLRN, PRN
  DFF Register_C_69 (.CLK(inst185_out), .D(Register_C_68_q), .Q(Register_C_69_q));  // open: CLRN, PRN
  // NOT inst371 has open pins: IN=IV_71, OUT=open
  DFF inst70 (.CLK(inst185_out), .D(inst69_q), .Q(inst70_q));  // open: CLRN, PRN
  // NOT inst450 has open pins: IN=Key_70, OUT=open
  DFF inst162 (.CLK(inst185_out), .D(inst161_q), .Q(inst162_q));  // open: CLRN, PRN
  DFF Register_C_70 (.CLK(inst185_out), .D(Register_C_69_q), .Q(Register_C_70_q));  // open: CLRN, PRN
  DFF inst71 (.CLK(inst185_out), .D(inst70_q), .Q(inst71_q));  // open: CLRN, PRN
  // NOT inst451 has open pins: IN=Key_71, OUT=open
  DFF inst163 (.CLK(inst185_out), .D(inst162_q), .Q(inst163_q));  // open: CLRN, PRN
  DFF Register_C_71 (.CLK(inst185_out), .D(Register_C_70_q), .Q(Register_C_71_q));  // open: CLRN, PRN
  // NOT inst372 has open pins: IN=IV_72, OUT=open
  DFF inst164 (.CLK(inst185_out), .D(inst163_q), .Q(inst164_q));  // open: CLRN, PRN
  // NOT inst373 has open pins: IN=IV_73, OUT=open
  DFF inst72 (.CLK(inst185_out), .D(inst71_q), .Q(inst72_q));  // open: CLRN, PRN
  // NOT inst452 has open pins: IN=Key_72, OUT=open
  DFF Register_C_72 (.CLK(inst185_out), .D(Register_C_71_q), .Q(Register_C_72_q));  // open: CLRN, PRN
  // NOT inst374 has open pins: IN=IV_74, OUT=open
  DFF inst73 (.CLK(inst185_out), .D(inst72_q), .Q(inst73_q));  // open: CLRN, PRN
  // NOT inst453 has open pins: IN=Key_73, OUT=open
  DFF inst165 (.CLK(inst185_out), .D(inst164_q), .Q(inst165_q));  // open: CLRN, PRN
  DFF Register_C_73 (.CLK(inst185_out), .D(Register_C_72_q), .Q(Register_C_73_q));  // open: CLRN, PRN
  // NOT inst375 has open pins: IN=IV_75, OUT=open
  DFF inst74 (.CLK(inst185_out), .D(inst73_q), .Q(inst74_q));  // open: CLRN, PRN
  // NOT inst454 has open pins: IN=Key_74, OUT=open
  DFF inst166 (.CLK(inst185_out), .D(inst165_q), .Q(inst166_q));  // open: CLRN, PRN
  DFF Register_C_74 (.CLK(inst185_out), .D(Register_C_73_q), .Q(Register_C_74_q));  // open: CLRN, PRN
  DFF inst75 (.CLK(inst185_out), .D(inst74_q), .Q(inst75_q));  // open: CLRN, PRN
  // NOT inst457 has open pins: IN=Key_75, OUT=open
  DFF inst167 (.CLK(inst185_out), .D(inst166_q), .Q(inst167_q));  // open: CLRN, PRN
  DFF Register_C_75 (.CLK(inst185_out), .D(Register_C_74_q), .Q(Register_C_75_q));  // open: CLRN, PRN
  // NOT inst376 has open pins: IN=IV_76, OUT=open
  DFF inst168 (.CLK(inst185_out), .D(inst167_q), .Q(inst168_q));  // open: CLRN, PRN
  // NOT inst377 has open pins: IN=IV_77, OUT=open
  DFF inst76 (.CLK(inst185_out), .D(inst75_q), .Q(inst76_q));  // open: CLRN, PRN
  // NOT inst458 has open pins: IN=Key_76, OUT=open
  DFF Register_C_76 (.CLK(inst185_out), .D(Register_C_75_q), .Q(Register_C_76_q));  // open: CLRN, PRN
  // NOT inst378 has open pins: IN=IV_78, OUT=open
  DFF inst77 (.CLK(inst185_out), .D(inst76_q), .Q(inst77_q));  // open: CLRN, PRN
  // NOT inst459 has open pins: IN=Key_77, OUT=open
  DFF inst169 (.CLK(inst185_out), .D(inst168_q), .Q(inst169_q));  // open: CLRN, PRN
  DFF Register_C_77 (.CLK(inst185_out), .D(Register_C_76_q), .Q(Register_C_77_q));  // open: CLRN, PRN
  // NOT inst379 has open pins: IN=IV_79, OUT=open
  DFF inst78 (.CLK(inst185_out), .D(inst77_q), .Q(inst78_q));  // open: CLRN, PRN
  // NOT inst460 has open pins: IN=Key_78, OUT=open
  DFF inst170 (.CLK(inst185_out), .D(inst169_q), .Q(inst170_q));  // open: CLRN, PRN
  DFF Register_C_78 (.CLK(inst185_out), .D(Register_C_77_q), .Q(Register_C_78_q));  // open: CLRN, PRN
  DFF inst79 (.CLK(inst185_out), .D(inst78_q), .Q(inst79_q));  // open: CLRN, PRN
  // NOT inst461 has open pins: IN=Key_79, OUT=open
  DFF inst171 (.CLK(inst185_out), .D(inst170_q), .Q(inst171_q));  // open: CLRN, PRN
  DFF Register_C_79 (.CLK(inst185_out), .D(Register_C_78_q), .Q(Register_C_79_q));  // open: CLRN, PRN
  // NOT inst380 has open pins: IN=IV_80, OUT=open
  DFF inst172 (.CLK(inst185_out), .D(inst171_q), .Q(inst172_q));  // open: CLRN, PRN
  DFF inst80 (.CLK(inst185_out), .D(inst79_q), .Q(inst80_q));  // open: CLRN, PRN
  // NOT inst462 has open pins: IN=Key_80, OUT=open
  DFF Register_C_80 (.CLK(inst185_out), .D(Register_C_79_q), .Q(Register_C_80_q));  // open: CLRN, PRN
  DFF inst81 (.CLK(inst185_out), .D(inst80_q), .Q(inst81_q));  // open: CLRN, PRN
  DFF inst173 (.CLK(inst185_out), .D(inst172_q), .Q(inst173_q));  // open: CLRN, PRN
  DFF Register_C_81 (.CLK(inst185_out), .D(Register_C_80_q), .Q(Register_C_81_q));  // open: CLRN, PRN
  DFF inst82 (.CLK(inst185_out), .D(inst81_q), .Q(inst82_q));  // open: CLRN, PRN
  DFF inst174 (.CLK(inst185_out), .D(inst173_q), .Q(inst174_q));  // open: CLRN, PRN
  DFF Register_C_82 (.CLK(inst185_out), .D(Register_C_81_q), .Q(Register_C_82_q));  // open: CLRN, PRN
  DFF inst83 (.CLK(inst185_out), .D(inst82_q), .Q(inst83_q));  // open: CLRN, PRN
  DFF inst175 (.CLK(inst185_out), .D(inst174_q), .Q(inst175_q));  // open: CLRN, PRN
  and inst300 (inst300_out, inst175_q, inst174_q);
  DFF Register_C_83 (.CLK(inst185_out), .D(Register_C_82_q), .Q(Register_C_83_q));  // open: CLRN, PRN
  DFF inst176 (.CLK(inst185_out), .D(inst175_q), .Q(inst176_q));  // open: CLRN, PRN
  DFF inst84 (.CLK(inst185_out), .D(inst83_q), .Q(inst84_q));  // open: CLRN, PRN
  DFF Register_C_84 (.CLK(inst185_out), .D(Register_C_83_q), .Q(Register_C_84_q));  // open: CLRN, PRN
  DFF inst85 (.CLK(inst185_out), .D(inst84_q), .Q(inst85_q));  // open: CLRN, PRN
  DFF Register_C_85 (.CLK(inst185_out), .D(Register_C_84_q), .Q(Register_C_85_q));  // open: CLRN, PRN
  DFF inst86 (.CLK(inst185_out), .D(inst85_q), .Q(inst86_q));  // open: CLRN, PRN
  XOR3 inst296 (.IN3(inst300_out), .IN1(inst161_q), .IN2(inst176_q), .OUT(inst296_out));
  DFF Register_C_86 (.CLK(inst185_out), .D(Register_C_85_q), .Q(Register_C_86_q));  // open: CLRN, PRN
  DFF inst87 (.CLK(inst185_out), .D(inst86_q), .Q(inst87_q));  // open: CLRN, PRN
  DFF Register_C_87 (.CLK(inst185_out), .D(Register_C_86_q), .Q(Register_C_87_q));  // open: CLRN, PRN
  DFF inst88 (.CLK(inst185_out), .D(inst87_q), .Q(inst88_q));  // open: CLRN, PRN
  DFF Register_C_88 (.CLK(inst185_out), .D(Register_C_87_q), .Q(Register_C_88_q));  // open: CLRN, PRN
  DFF inst89 (.CLK(inst185_out), .D(inst88_q), .Q(inst89_q));  // open: CLRN, PRN
  DFF Register_C_89 (.CLK(inst185_out), .D(Register_C_88_q), .Q(Register_C_89_q));  // open: CLRN, PRN
  DFF inst90 (.CLK(inst185_out), .D(inst89_q), .Q(inst90_q));  // open: CLRN, PRN
  DFF Register_C_90 (.CLK(inst185_out), .D(Register_C_89_q), .Q(Register_C_90_q));  // open: CLRN, PRN
  DFF inst91 (.CLK(inst185_out), .D(inst90_q), .Q(inst91_q));  // open: CLRN, PRN
  DFF Register_C_91 (.CLK(inst185_out), .D(Register_C_90_q), .Q(Register_C_91_q));  // open: CLRN, PRN
  and inst299 (inst299_out, inst91_q, inst90_q);
  DFF inst92 (.CLK(inst185_out), .D(inst91_q), .Q(inst92_q));  // open: CLRN, PRN
  DFF Register_C_92 (.CLK(inst185_out), .D(Register_C_91_q), .Q(Register_C_92_q));  // open: CLRN, PRN
  DFF Register_C_93 (.CLK(inst185_out), .D(Register_C_92_q), .Q(Register_C_93_q));  // open: CLRN, PRN
  XOR3 inst295 (.IN3(inst299_out), .IN1(inst65_q), .IN2(inst92_q), .OUT(inst295_out));
  DFF Register_C_94 (.CLK(inst185_out), .D(Register_C_93_q), .Q(Register_C_94_q));  // open: CLRN, PRN
  DFF Register_C_95 (.CLK(inst185_out), .D(Register_C_94_q), .Q(Register_C_95_q));  // open: CLRN, PRN
  DFF Register_C_96 (.CLK(inst185_out), .D(Register_C_95_q), .Q(Register_C_96_q));  // open: CLRN, PRN
  DFF Register_C_97 (.CLK(inst185_out), .D(Register_C_96_q), .Q(Register_C_97_q));  // open: CLRN, PRN
  DFF Register_C_98 (.CLK(inst185_out), .D(Register_C_97_q), .Q(Register_C_98_q));  // open: CLRN, PRN
  XOR3 inst298 (.IN3(inst297_out), .IN1(inst295_out), .IN2(inst296_out), .OUT(inst298_out));
  DFF Register_C_99 (.CLK(inst185_out), .D(Register_C_98_q), .Q(Register_C_99_q));  // open: CLRN, PRN
  DFF Register_C_100 (.CLK(inst185_out), .D(Register_C_99_q), .Q(Register_C_100_q));  // open: CLRN, PRN
  and inst219 (KEYSTREAM, filter_out, inst298_out);
  DFF Register_C_101 (.CLK(inst185_out), .D(Register_C_100_q), .Q(Register_C_101_q));  // open: CLRN, PRN
  xor inst222 (inst222_out, KEYSTREAM, message);
  DFF Register_C_102 (.CLK(inst185_out), .D(Register_C_101_q), .Q(Register_C_102_q));  // open: CLRN, PRN
  xor inst224 (inst224_out, inst222_out, KEYSTREAM);
  DFF Register_C_103 (.CLK(inst185_out), .D(Register_C_102_q), .Q(Register_C_103_q));  // open: CLRN, PRN
  and inst465 (Cipher, filter_out, inst222_out);
  and inst1456 (Message_Decrypted, filter_out, inst224_out);
  DFF Register_C_104 (.CLK(inst185_out), .D(Register_C_103_q), .Q(Register_C_104_q));  // open: CLRN, PRN
  DFF Register_C_105 (.CLK(inst185_out), .D(Register_C_104_q), .Q(Register_C_105_q));  // open: CLRN, PRN
  DFF Register_C_106 (.CLK(inst185_out), .D(Register_C_105_q), .Q(Register_C_106_q));  // open: CLRN, PRN
  DFF Register_C_107 (.CLK(inst185_out), .D(Register_C_106_q), .Q(Register_C_107_q));  // open: CLRN, PRN
  DFF Register_C_108 (.CLK(inst185_out), .D(Register_C_107_q), .Q(Register_C_108_q));  // open: CLRN, PRN
  not inst34234 (inst34234_out, last3_ip);
  DFF Register_C_109 (
    .CLK(inst185_out), .D(Register_C_108_q), .PRN(inst34234_out), .Q(Register_C_109_q));  // open: CLRN
  DFF Register_C_110 (
    .CLK(inst185_out), .D(Register_C_109_q), .PRN(inst34234_out), .Q(Register_C_110_q));  // open: CLRN
  DFF Register_C_111 (
    .CLK(inst185_out), .D(Register_C_110_q), .PRN(inst34234_out), .Q(Register_C_111_q));  // open: CLRN
  and inst301 (inst301_out, Register_C_110_q, Register_C_109_q);
  XOR3 inst297 (.IN3(inst301_out), .IN1(Register_C_66_q), .IN2(Register_C_111_q), .OUT(inst297_out));

  // Notes on the sheet:
  //   TRIVIUM CIPHER STREAM
  //   REGISTER A
  //   REGISTER B
  //   REGISTER C
endmodule
